# EAGLE design Controle_16_reles V5 (EAGLE 4.09)
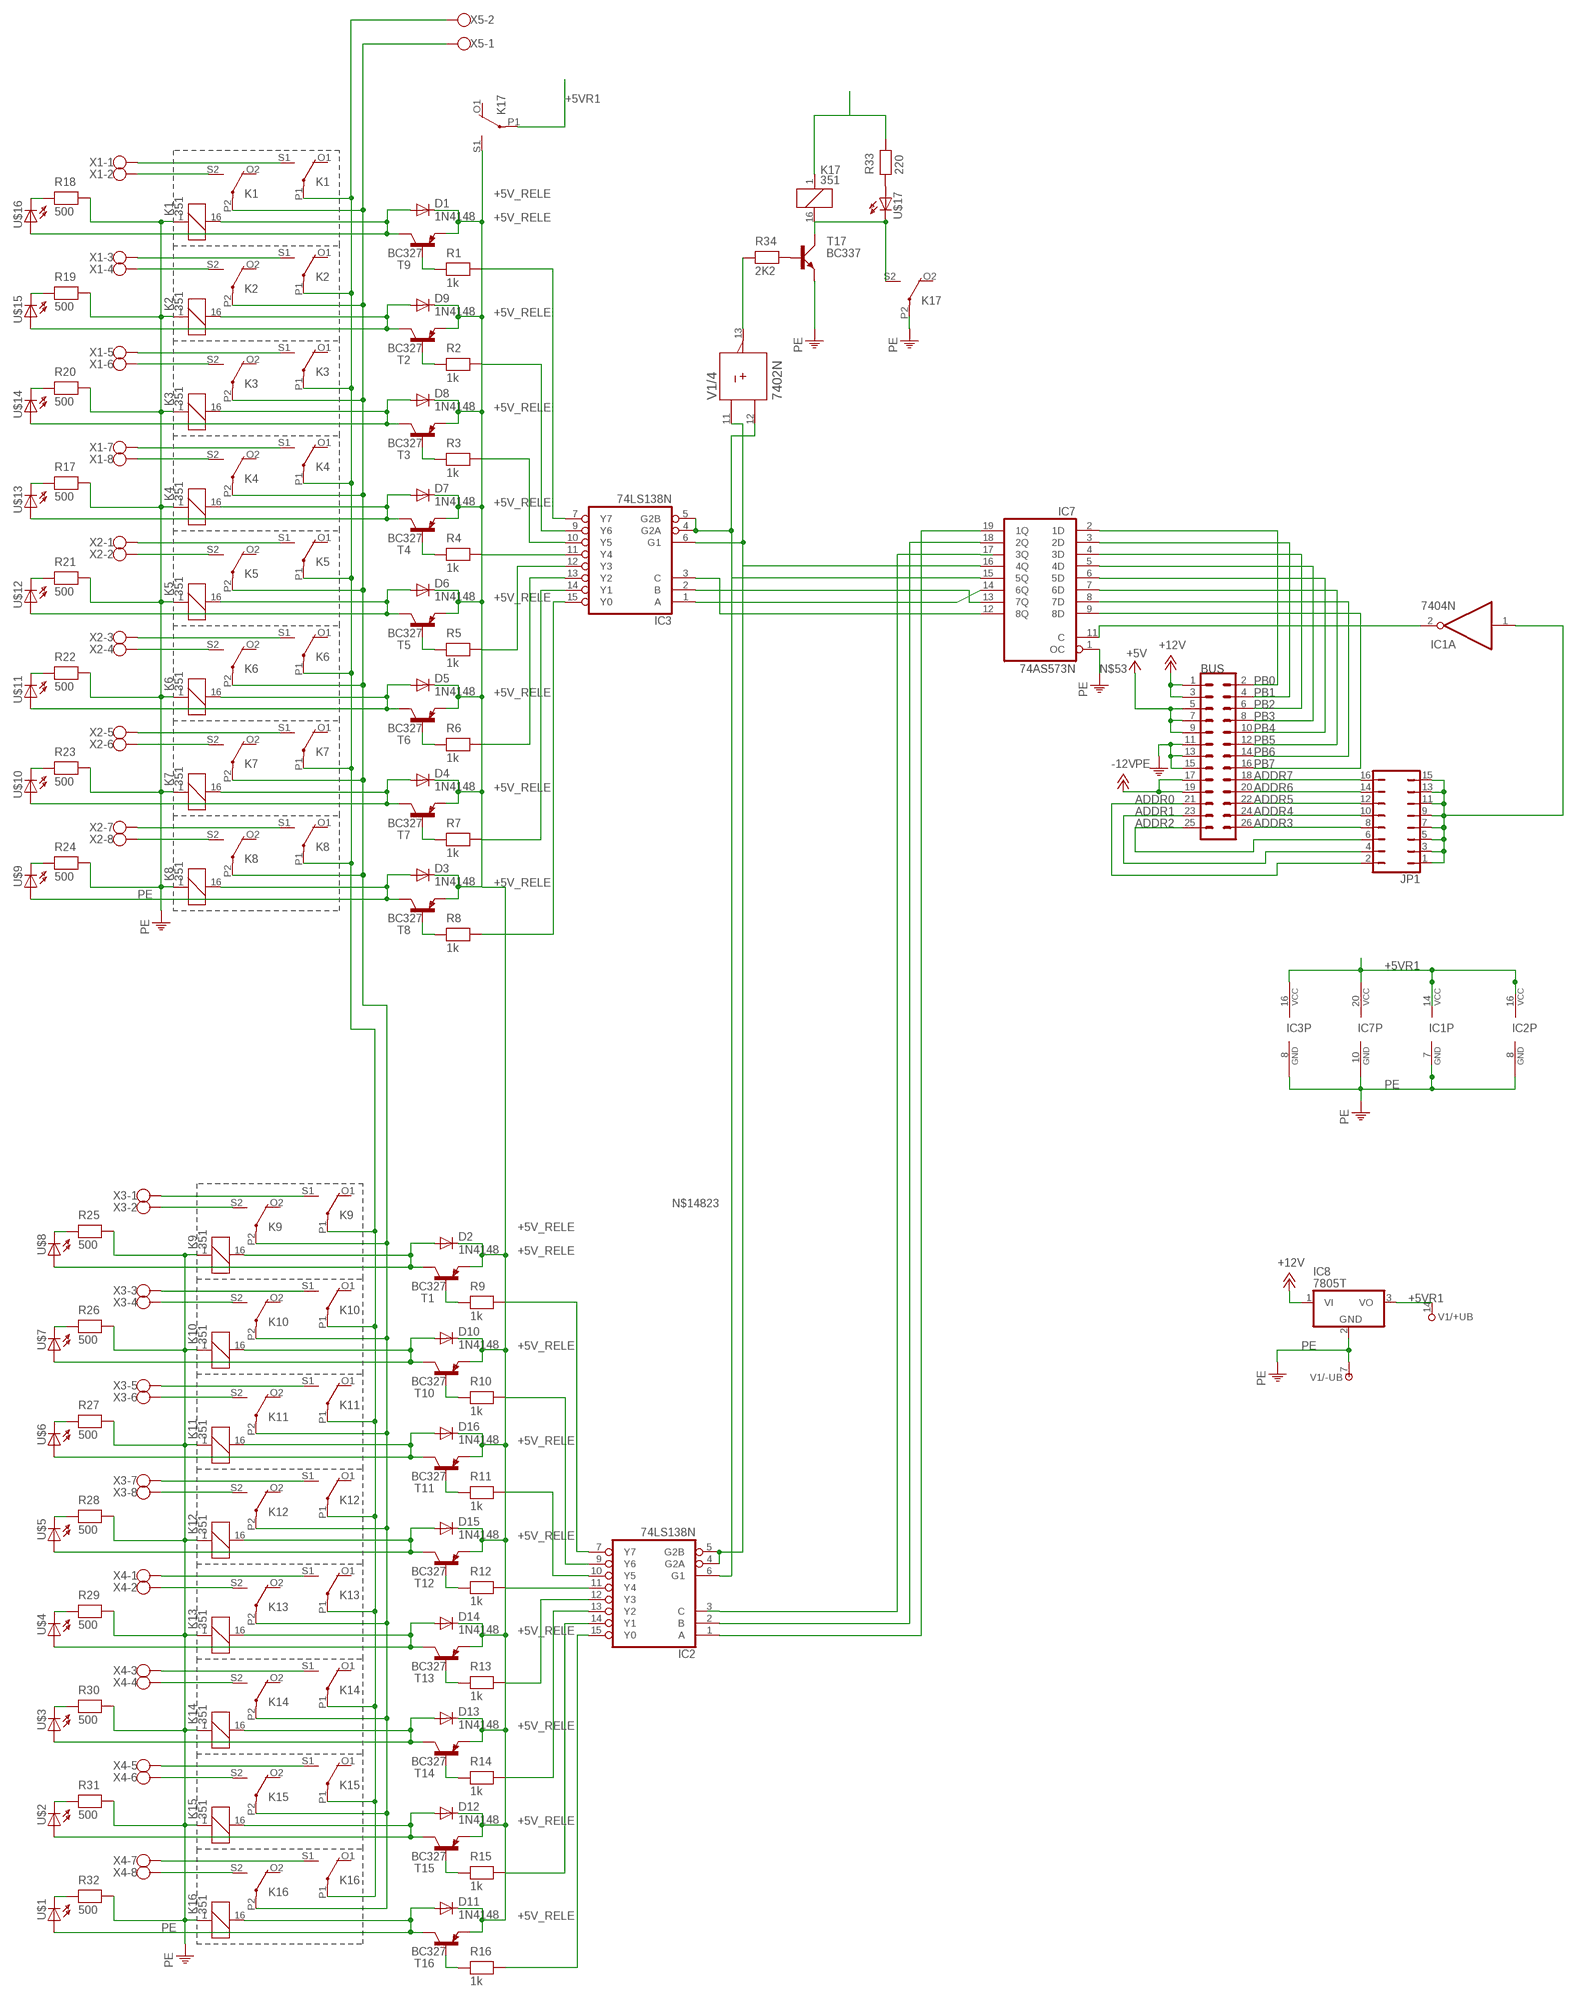
[diagram p0: schematic, sheet 1]

## Parts
BUS  ML26  [ML26]
D1  1N4148  [DO35-10]
D2  1N4148  [DO35-10]
D3  1N4148  [DO35-10]
D4  1N4148  [DO35-10]
D5  1N4148  [DO35-10]
D6  1N4148  [DO35-10]
D7  1N4148  [DO35-10]
D8  1N4148  [DO35-10]
D9  1N4148  [DO35-10]
D10  1N4148  [DO35-10]
D11  1N4148  [DO35-10]
D12  1N4148  [DO35-10]
D13  1N4148  [DO35-10]
D14  1N4148  [DO35-10]
D15  1N4148  [DO35-10]
D16  1N4148  [DO35-10]
IC1  7404N  [DIL14]
IC2  74LS138N  [DIL16]
IC3  74LS138N  [DIL16]
IC7  74AS573N  [DIL20]
IC8  7805T  [TO220H]
JP1  JP8Q  [JP8Q]
K1  351  [351]
K2  351  [351]
K3  351  [351]
K4  351  [351]
K5  351  [351]
K6  351  [351]
K7  351  [351]
K8  351  [351]
K9  351  [351]
K10  351  [351]
K11  351  [351]
K12  351  [351]
K13  351  [351]
K14  351  [351]
K15  351  [351]
K16  351  [351]
K17  351  [351]
R1  1k  RESEU-10  [R-10]
R2  1k  RESEU-10  [R-10]
R3  1k  RESEU-10  [R-10]
R4  1k  RESEU-10  [R-10]
R5  1k  RESEU-10  [R-10]
R6  1k  RESEU-10  [R-10]
R7  1k  RESEU-10  [R-10]
R8  1k  RESEU-10  [R-10]
R9  1k  RESEU-10  [R-10]
R10  1k  RESEU-10  [R-10]
R11  1k  RESEU-10  [R-10]
R12  1k  RESEU-10  [R-10]
R13  1k  RESEU-10  [R-10]
R14  1k  RESEU-10  [R-10]
R15  1k  RESEU-10  [R-10]
R16  1k  RESEU-10  [R-10]
R17  500  RESEU-10  [R-10]
R18  500  RESEU-10  [R-10]
R19  500  RESEU-10  [R-10]
R20  500  RESEU-10  [R-10]
R21  500  RESEU-10  [R-10]
R22  500  RESEU-10  [R-10]
R23  500  RESEU-10  [R-10]
R24  500  RESEU-10  [R-10]
R25  500  RESEU-10  [R-10]
R26  500  RESEU-10  [R-10]
R27  500  RESEU-10  [R-10]
R28  500  RESEU-10  [R-10]
R29  500  RESEU-10  [R-10]
R30  500  RESEU-10  [R-10]
R31  500  RESEU-10  [R-10]
R32  500  RESEU-10  [R-10]
R33  220  RESEU-10  [R-10]
R34  2K2  RESEU-10  [R-10]
T1  BC327  [TO92]
T2  BC327  [TO92]
T3  BC327  [TO92]
T4  BC327  [TO92]
T5  BC327  [TO92]
T6  BC327  [TO92]
T7  BC327  [TO92]
T8  BC327  [TO92]
T9  BC327  [TO92]
T10  BC327  [TO92]
T11  BC327  [TO92]
T12  BC327  [TO92]
T13  BC327  [TO92]
T14  BC327  [TO92]
T15  BC327  [TO92]
T16  BC327  [TO92]
T17  BC337  [SOT54A]
U$1  LED3MM  [LED3MM]
U$2  LED3MM  [LED3MM]
U$3  LED3MM  [LED3MM]
U$4  LED3MM  [LED3MM]
U$5  LED3MM  [LED3MM]
U$6  LED3MM  [LED3MM]
U$7  LED3MM  [LED3MM]
U$8  LED3MM  [LED3MM]
U$9  LED3MM  [LED3MM]
U$10  LED3MM  [LED3MM]
U$11  LED3MM  [LED3MM]
U$12  LED3MM  [LED3MM]
U$13  LED3MM  [LED3MM]
U$14  LED3MM  [LED3MM]
U$15  LED3MM  [LED3MM]
U$16  LED3MM  [LED3MM]
U$17  LED3MM  [LED3MM]
V1  7402N  [DIL14]
X1  AK500/8  [AK500/8]
X2  AK500/8  [AK500/8]
X3  AK500/8  [AK500/8]
X4  AK500/8  [AK500/8]
X5  AK300/2  [AK300/2]

## Nets
+5V: BUS.5 BUS.7 BUS.9
+5V_RELE: D1.C D2.C D3.C D4.C D5.C D6.C D7.C D8.C D9.C D10.C D11.C D12.C D13.C D14.C D15.C D16.C K17.S1(2:S) T1.1(E) T2.1(E) T3.1(E) T4.1(E) T5.1(E) T6.1(E) T7.1(E) T8.1(E) T9.1(E) T10.1(E) T11.1(E) T12.1(E) T13.1(E) T14.1(E) T15.1(E) T16.1(E)
+5VR1: IC1.14(P:VCC) IC2.16(VCC) IC3.16(VCC) IC7.20(VCC) IC8.3(VO) K17.1 K17.P1(2:P) R33.2 V1.14(/+UB:+UB)
+12V: BUS.1 BUS.3 IC8.1(VI)
-12V: BUS.17 BUS.19
ADDR0: BUS.21 JP1.2
ADDR1: BUS.23 JP1.4
ADDR2: BUS.25 JP1.6
ADDR3: BUS.26 JP1.8
ADDR4: BUS.24 JP1.10
ADDR5: BUS.22 JP1.12
ADDR6: BUS.20 JP1.14
ADDR7: BUS.18 JP1.16
GARANTIA1: IC2.6(G1) IC3.4(G2A) IC3.5(G2B) IC7.15(5Q) V1.12(/4:B)
GARANTIA2: IC2.4(G2A) IC2.5(G2B) IC3.6(G1) IC7.16(4Q) V1.11(/4:A)
N$1: R9.1 T1.2(B)
N$2: R5.1 T5.2(B)
N$3: IC3.7(Y7) R1.2
N$4: IC3.9(Y6) R2.2
N$5: IC3.10(Y5) R3.2
N$6: IC3.11(Y4) R4.2
N$7: IC3.15(Y0) R8.2
N$8: IC3.14(Y1) R7.2
N$9: IC3.13(Y2) R6.2
N$10: R1.1 T9.2(B)
N$12: IC2.2(B) IC7.18(2Q)
N$13: R34.2 T17.B
N$15: D6.A K5.16 T5.3(C) U$12.A
N$16: K17.16 K17.S2(3:S) T17.C U$17.K(C)
N$17: R2.1 T2.2(B)
N$18: D1.A K1.16 T9.3(C) U$16.A
N$19: D9.A K2.16 T2.3(C) U$15.A
N$20: R6.1 T6.2(B)
N$21: R3.1 T3.2(B)
N$22: D8.A K3.16 T3.3(C) U$14.A
N$23: D5.A K6.16 T6.3(C) U$11.A
N$24: R4.1 T4.2(B)
N$25: D7.A K4.16 T4.3(C) U$13.A
N$26: R7.1 T7.2(B)
N$27: D4.A K7.16 T7.3(C) U$10.A
N$28: R8.1 T8.2(B)
N$29: D3.A K8.16 T8.3(C) U$9.A
N$30: IC3.12(Y3) R5.2
N$32: R34.1 V1.13(/4:Y)
N$33: IC1.1(A:I) JP1.1 JP1.3 JP1.5 JP1.7 JP1.9 JP1.11 JP1.13 JP1.15
N$34: IC3.1(A) IC7.14(6Q)
N$35: K1.S1(2:S) X1.1
N$36: K1.S2(3:S) X1.2
N$37: K2.S1(2:S) X1.3
N$38: K2.S2(3:S) X1.4
N$39: K3.S1(2:S) X1.5
N$40: K3.S2(3:S) X1.6
N$41: K4.S1(2:S) X1.7
N$42: K4.S2(3:S) X1.8
N$43: K5.S1(2:S) X2.1
N$44: K5.S2(3:S) X2.2
N$45: K6.S1(2:S) X2.3
N$46: K6.S2(3:S) X2.4
N$47: K7.S1(2:S) X2.5
N$48: K7.S2(3:S) X2.6
N$49: K8.S1(2:S) X2.7
N$50: K8.S2(3:S) X2.8
N$51: R18.1 U$16.K(C)
N$52: D2.A K9.16 T1.3(C) U$8.A
N$53: IC1.2(A:O) IC7.11(C)
N$54: R10.1 T10.2(B)
N$55: D10.A K10.16 T10.3(C) U$7.A
N$56: R11.1 T11.2(B)
N$57: D16.A K11.16 T11.3(C) U$6.A
N$58: R12.1 T12.2(B)
N$60: D15.A K12.16 T12.3(C) U$5.A
N$61: R13.1 T13.2(B)
N$62: D14.A K13.16 T13.3(C) U$4.A
N$63: R14.1 T14.2(B)
N$64: D13.A K14.16 T14.3(C) U$3.A
N$65: R15.1 T15.2(B)
N$66: D12.A K15.16 T15.3(C) U$2.A
N$67: R16.1 T16.2(B)
N$68: D11.A K16.16 T16.3(C) U$1.A
N$69: IC2.7(Y7) R9.2
N$70: IC2.9(Y6) R10.2
N$71: IC2.10(Y5) R11.2
N$72: IC2.11(Y4) R12.2
N$73: IC2.15(Y0) R16.2
N$74: IC2.14(Y1) R15.2
N$75: IC2.13(Y2) R14.2
N$76: IC2.12(Y3) R13.2
N$77: IC3.2(B) IC7.13(7Q)
N$78: K9.S1(2:S) X3.1
N$79: K9.S2(3:S) X3.2
N$80: K10.S1(2:S) X3.3
N$81: K10.S2(3:S) X3.4
N$82: K11.S1(2:S) X3.5
N$83: K11.S2(3:S) X3.6
N$84: K12.S1(2:S) X3.7
N$85: K12.S2(3:S) X3.8
N$86: K13.S1(2:S) X4.1
N$87: K13.S2(3:S) X4.2
N$88: K14.S1(2:S) X4.3
N$89: K14.S2(3:S) X4.4
N$90: K15.S1(2:S) X4.5
N$91: K15.S2(3:S) X4.6
N$92: K16.S1(2:S) X4.7
N$93: K16.S2(3:S) X4.8
N$94: R20.1 U$14.K(C)
N$95: R19.1 U$15.K(C)
N$96: R32.1 U$1.K(C)
N$97: IC3.3(C) IC7.12(8Q)
N$98: R17.1 U$13.K(C)
N$112: R33.1 U$17.A
N$114: IC2.3(C) IC7.17(3Q)
N$118: IC2.1(A) IC7.19(1Q)
N$148: K1.P1(2:P) K2.P1(2:P) K3.P1(2:P) K4.P1(2:P) K5.P1(2:P) K6.P1(2:P) K7.P1(2:P) K8.P1(2:P) K9.P1(2:P) K10.P1(2:P) K11.P1(2:P) K12.P1(2:P) K13.P1(2:P) K14.P1(2:P) K15.P1(2:P) K16.P1(2:P) X5.2
N$150: R21.1 U$12.K(C)
N$153: R22.1 U$11.K(C)
N$156: R23.1 U$10.K(C)
N$160: R24.1 U$9.K(C)
N$163: R25.1 U$8.K(C)
N$165: R26.1 U$7.K(C)
N$169: R27.1 U$6.K(C)
N$171: R28.1 U$5.K(C)
N$174: R29.1 U$4.K(C)
N$177: R30.1 U$3.K(C)
N$180: R31.1 U$2.K(C)
N$14823: K1.P2(3:P) K2.P2(3:P) K3.P2(3:P) K4.P2(3:P) K5.P2(3:P) K6.P2(3:P) K7.P2(3:P) K8.P2(3:P) K9.P2(3:P) K10.P2(3:P) K11.P2(3:P) K12.P2(3:P) K13.P2(3:P) K14.P2(3:P) K15.P2(3:P) K16.P2(3:P) X5.1
PB0: BUS.2 IC7.2(1D)
PB1: BUS.4 IC7.3(2D)
PB2: BUS.6 IC7.4(3D)
PB3: BUS.8 IC7.5(4D)
PB4: BUS.10 IC7.6(5D)
PB5: BUS.12 IC7.7(6D)
PB6: BUS.14 IC7.8(7D)
PB7: BUS.16 IC7.9(8D)
PE: BUS.11 BUS.13 BUS.15 IC1.7(P:GND) IC2.8(GND) IC3.8(GND) IC7.1(OC) IC7.10(GND) IC8.2(GND) K1.1 K2.1 K3.1 K4.1 K5.1 K6.1 K7.1 K8.1 K9.1 K10.1 K11.1 K12.1 K13.1 K14.1 K15.1 K16.1 K17.P2(3:P) R17.2 R18.2 R19.2 R20.2 R21.2 R22.2 R23.2 R24.2 R25.2 R26.2 R27.2 R28.2 R29.2 R30.2 R31.2 R32.2 T17.E V1.7(/-UB:-UB)
Unconnected: IC1.3(B:I) IC1.4(B:O) IC1.5(C:I) IC1.6(C:O) IC1.8(D:O) IC1.9(D:I) IC1.10(E:O) IC1.11(E:I) IC1.12(F:O) IC1.13(F:I) K1.O1(2:O) K1.O2(3:O) K2.O1(2:O) K2.O2(3:O) K3.O1(2:O) K3.O2(3:O) K4.O1(2:O) K4.O2(3:O) K5.O1(2:O) K5.O2(3:O) K6.O1(2:O) K6.O2(3:O) K7.O1(2:O) K7.O2(3:O) K8.O1(2:O) K8.O2(3:O) K9.O1(2:O) K9.O2(3:O) K10.O1(2:O) K10.O2(3:O) K11.O1(2:O) K11.O2(3:O) K12.O1(2:O) K12.O2(3:O) K13.O1(2:O) K13.O2(3:O) K14.O1(2:O) K14.O2(3:O) K15.O1(2:O) K15.O2(3:O) K16.O1(2:O) K16.O2(3:O) K17.O1(2:O) K17.O2(3:O) V1.1(/1:Y) V1.2(/1:A) V1.3(/1:B) V1.4(/2:Y) V1.5(/2:A) V1.6(/2:B) V1.8(/3:A) V1.9(/3:B) V1.10(/3:Y)

## Library data of the parts
BUS = con-harting-ml:ML26: HARTING
D1-D16 = diode:1N4148: DIODE high speed (Philips)
IC1 = 74xx-us:74*04: Hex INVERTER
IC2 IC3 = 74xx-us:74*138: 3-line to 8-line DECODER/DEMULTIPLEXER
IC7 = 74xx-us:74*573: 8-bit D latch BUS DRIVER
IC8 = linear:78*: Positive VOLTAGE REGULATOR
JP1 = jumper:JP8Q: JUMPER
K1-K17 = relay:351: RELAY 2 x switch, Omron
R1-R34 = discrete:RESEU-10
T1-T16 = transistor-pnp:BC327: PNP Transistor
T17 = transistor-small-signal:BC337: NPN TRANSISTOR
U$1-U$17 = led:LED: LED
V1 = 74ttl-din:74*02: Quad 2-input NOR gate
X1-X4 = con-ptr500:AK500/8: CONNECTOR
X5 = con-ptr500:AK300/2: CONNECTOR

## Board
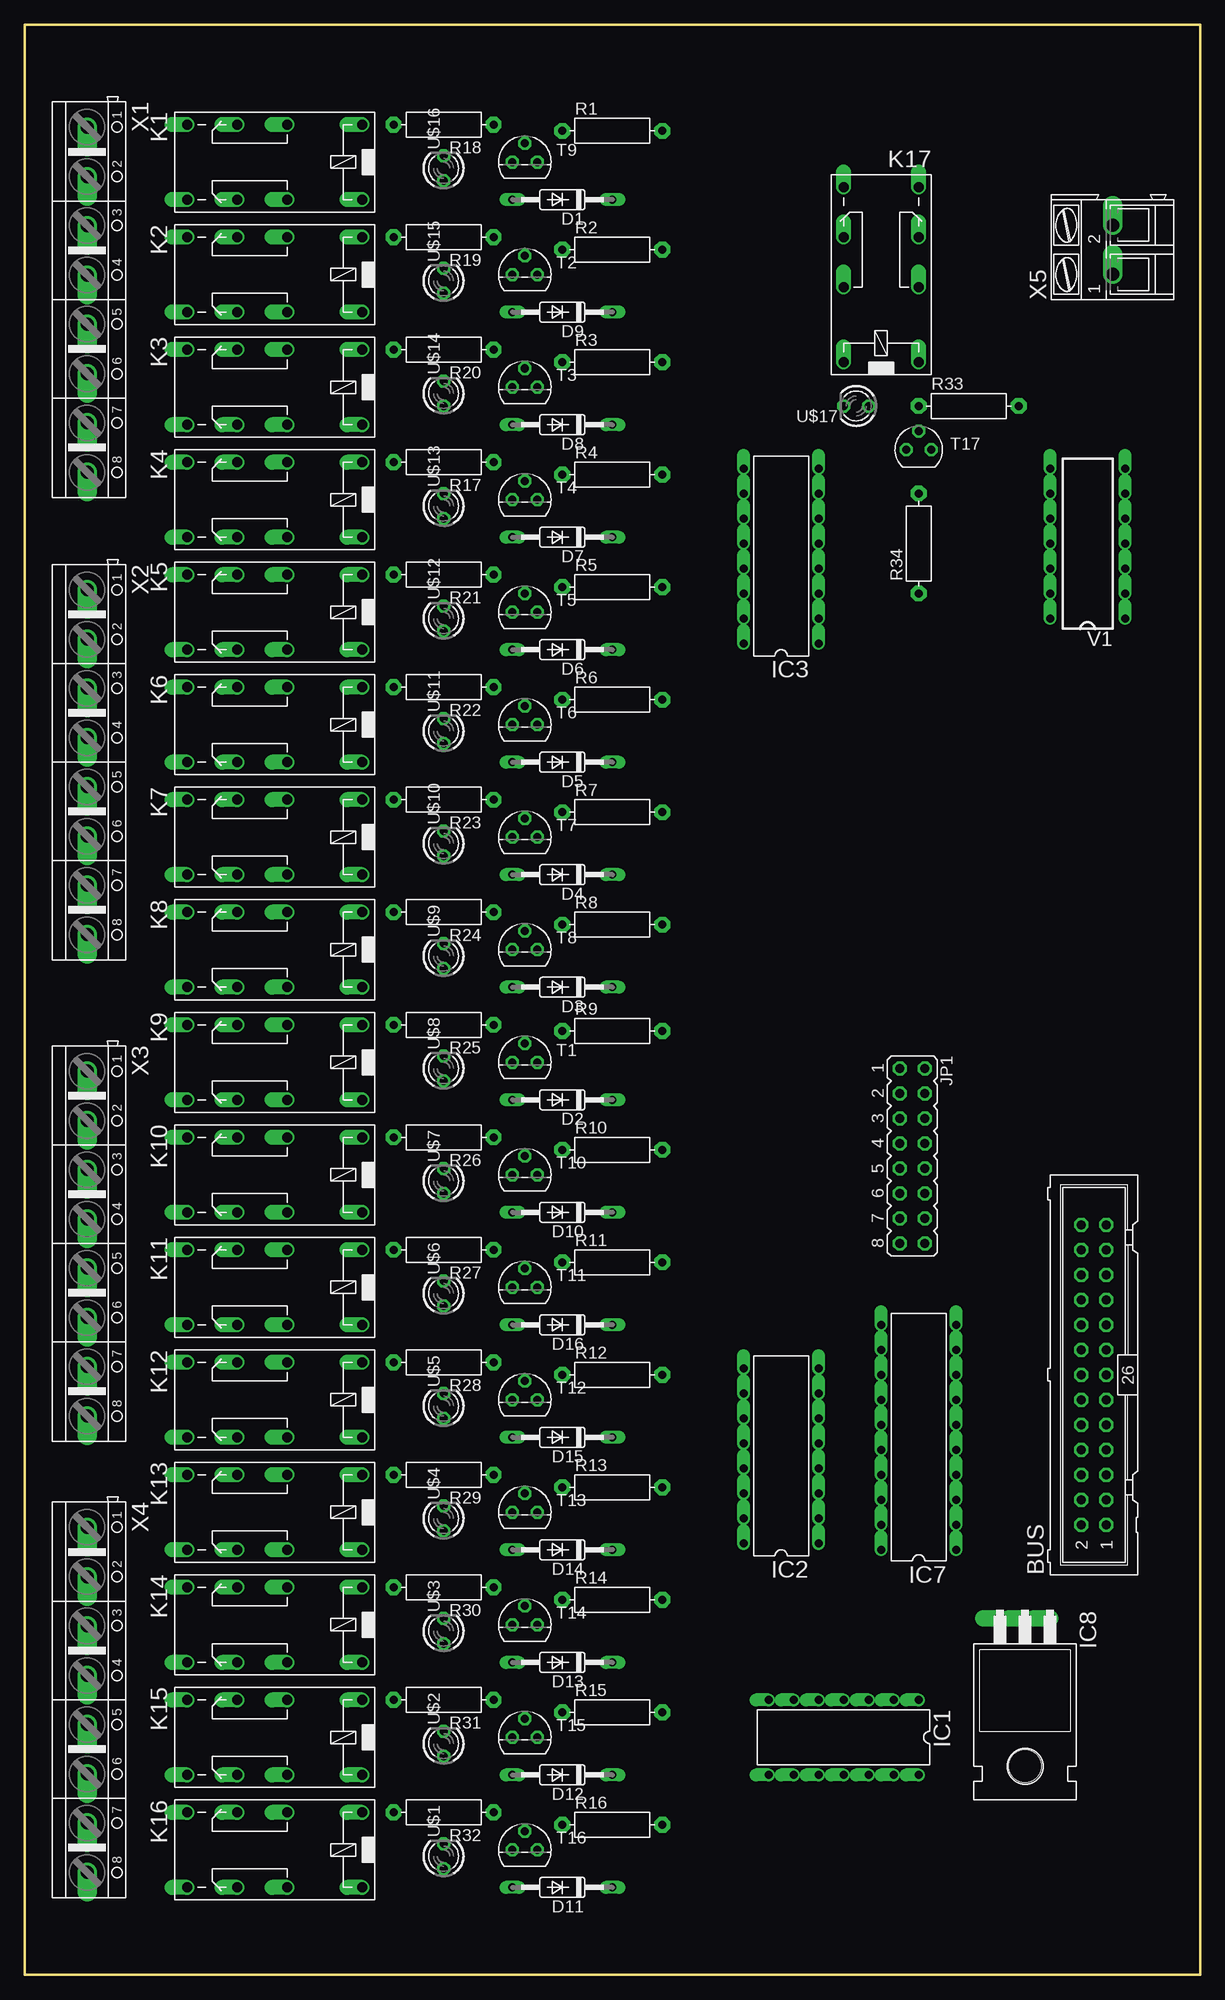
[diagram p1: board, top side]
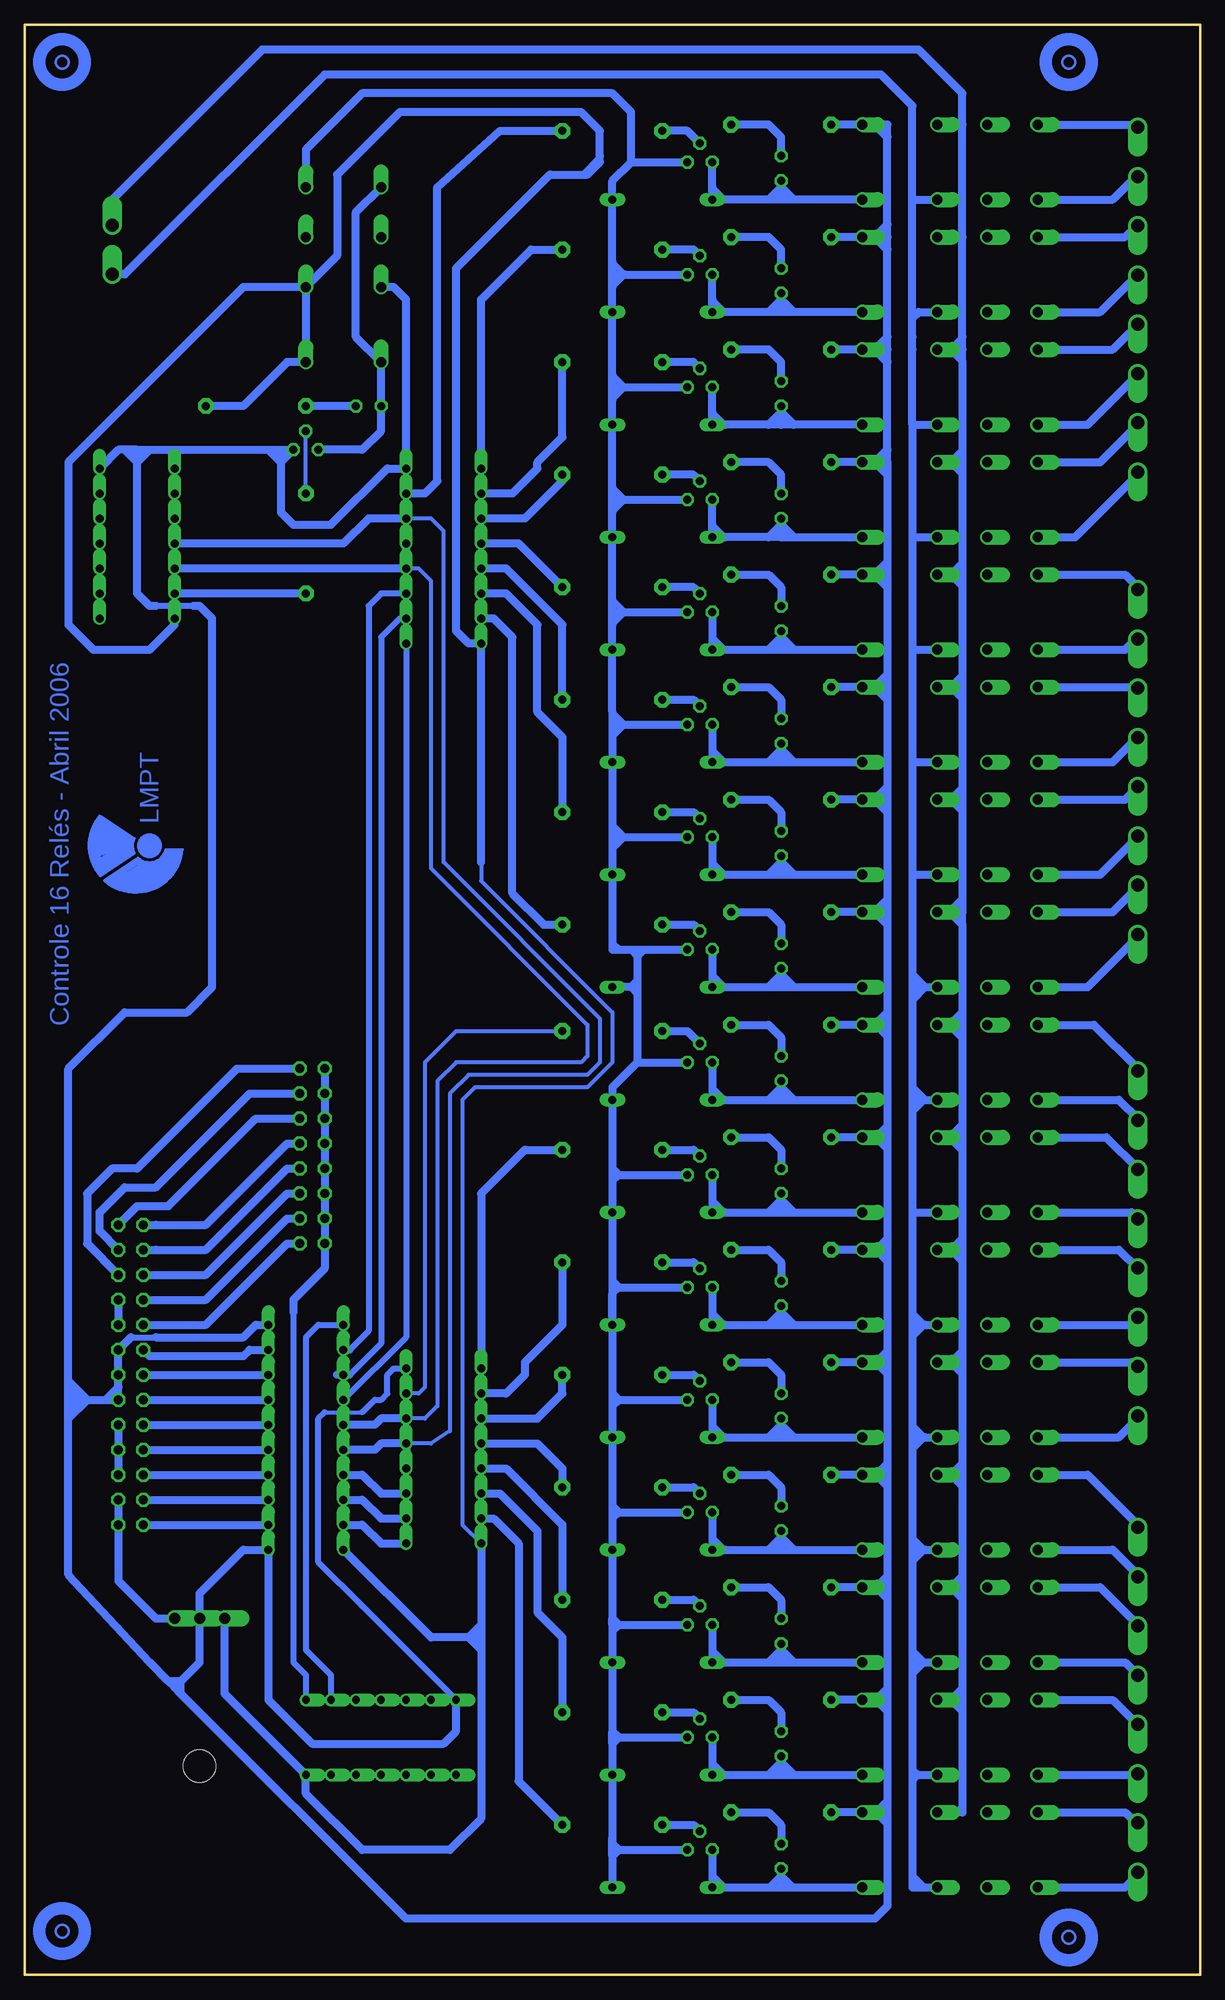
[diagram p2: board, bottom side, seen from below]

Size 119.38 x 198.12 mm. Coordinates in mm from the lower left corner, seen from the top.
Outline: 119.38,198.12 119.38,0 0,0 0,198.12 119.38,198.12
Copper layers used: Bottom

### Footprints (pad centres in the part's own frame; a part is rotated, then mirrored left to right if it is on the bottom)
ML26 = drill 0.914 octagon: 1 -15.24,-1.27; 2 -15.24,1.27; 3 -12.7,-1.27; 4 -12.7,1.27; 5 -10.16,-1.27; 6 -10.16,1.27; 7 -7.62,-1.27; 8 -7.62,1.27; 9 -5.08,-1.27; 10 -5.08,1.27; 11 -2.54,-1.27; 12 -2.54,1.27; 13 0,-1.27; 14 0,1.27; 15 2.54,-1.27; 16 2.54,1.27; 17 5.08,-1.27; 18 5.08,1.27; 19 7.62,-1.27; 20 7.62,1.27; 21 10.16,-1.27; 22 10.16,1.27; 23 12.7,-1.27; 24 12.7,1.27; 25 15.24,-1.27; 26 15.24,1.27
DO35-10 = drill 0.813 long: A 5.08,0; C -5.08,0
DIL14 = drill 0.8 offset: 1 -7.62,-3.81; 2 -5.08,-3.81; 3 -2.54,-3.81; 4 0,-3.81; 5 2.54,-3.81; 6 5.08,-3.81; 7 7.62,-3.81; 8 7.62,3.81; 9 5.08,3.81; 10 2.54,3.81; 11 0,3.81; 12 -2.54,3.81; 13 -5.08,3.81; 14 -7.62,3.81
DIL16 = drill 0.813 offset: 1 -8.89,-3.81; 2 -6.35,-3.81; 3 -3.81,-3.81; 4 -1.27,-3.81; 5 1.27,-3.81; 6 3.81,-3.81; 7 6.35,-3.81; 8 8.89,-3.81; 9 8.89,3.81; 10 6.35,3.81; 11 3.81,3.81; 12 1.27,3.81; 13 -1.27,3.81; 14 -3.81,3.81; 15 -6.35,3.81; 16 -8.89,3.81
DIL20 = drill 0.813 offset: 1 -11.43,-3.81; 2 -8.89,-3.81; 3 -6.35,-3.81; 4 -3.81,-3.81; 5 -1.27,-3.81; 6 1.27,-3.81; 7 3.81,-3.81; 8 6.35,-3.81; 9 8.89,-3.81; 10 11.43,-3.81; 11 11.43,3.81; 12 8.89,3.81; 13 6.35,3.81; 14 3.81,3.81; 15 1.27,3.81; 16 -1.27,3.81; 17 -3.81,3.81; 18 -6.35,3.81; 19 -8.89,3.81; 20 -11.43,3.81
TO220H = drill 1.118 offset: 1 -2.54,-10.16; 2 0,-10.16; 3 2.54,-10.16 | hole 3.302: 0,4.826
JP8Q = drill 0.914 octagon: 1 -8.89,-1.27; 2 -8.89,1.27; 3 -6.35,-1.27; 4 -6.35,1.27; 5 -3.81,-1.27; 6 -3.81,1.27; 7 -1.27,-1.27; 8 -1.27,1.27; 9 1.27,-1.27; 10 1.27,1.27; 11 3.81,-1.27; 12 3.81,1.27; 13 6.35,-1.27; 14 6.35,1.27; 15 8.89,-1.27; 16 8.89,1.27
351 = drill 1.016 offset: 1 -3.81,-3.81; 16 -3.81,3.81; O1 8.89,-3.81; O2 8.89,3.81; P1 3.81,-3.81; P2 3.81,3.81; S1 13.97,-3.81; S2 13.97,3.81
R-10 = drill 0.813 pad 1.6 octagon: 1 -5.08,0; 2 5.08,0
TO92 = drill 0.813 octagon: 1 1.27,0; 2 0,1.905; 3 -1.27,0
SOT54A = drill 0.813 octagon: B 0,1.905; C -1.27,0; E 1.27,0
LED3MM = drill 0.813 octagon: A -1.27,0; K 1.27,0
DIL14' = drill 0.813 offset: 1 -7.62,-3.81; 2 -5.08,-3.81; 3 -2.54,-3.81; 4 0,-3.81; 5 2.54,-3.81; 6 5.08,-3.81; 7 7.62,-3.81; 8 7.62,3.81; 9 5.08,3.81; 10 2.54,3.81; 11 0,3.81; 12 -2.54,3.81; 13 -5.08,3.81; 14 -7.62,3.81
AK500/8 = drill 1.321 offset: 1 -17.526,0; 2 -12.497,0; 3 -7.518,0; 4 -2.489,0; 5 2.489,0; 6 7.518,0; 7 12.497,0; 8 17.526,0
AK300/2 = drill 1.321 offset: 1 -2.515,0; 2 2.489,0

### Placement (x,y rotation side)
BUS  108.59,60.96 90 top
D1  54.61,180.34 180 top
D2  54.61,88.9 180 top
D3  54.61,100.33 180 top
D4  54.61,111.76 180 top
D5  54.61,123.19 180 top
D6  54.61,134.62 180 top
D7  54.61,146.05 180 top
D8  54.61,157.48 180 top
D9  54.61,168.91 180 top
D10  54.61,77.47 180 top
D11  54.61,8.89 180 top
D12  54.61,20.32 180 top
D13  54.61,31.75 180 top
D14  54.61,43.18 180 top
D15  54.61,54.61 180 top
D16  54.61,66.04 180 top
IC1  83.19,24.13 180 top
IC2  76.83,52.7 90 top
IC3  76.83,144.14 90 top
IC7  90.8,54.61 90 top
IC8  101.6,26.03 180 top
JP1  90.17,83.19 270 top
K1  30.48,184.15 180 top
K2  30.48,172.72 180 top
K3  30.48,161.29 180 top
K4  30.48,149.86 180 top
K5  30.48,138.43 180 top
K6  30.48,127 180 top
K7  30.48,115.57 180 top
K8  30.48,104.14 180 top
K9  30.48,92.71 180 top
K10  30.48,81.28 180 top
K11  30.48,69.85 180 top
K12  30.48,58.42 180 top
K13  30.48,46.99 180 top
K14  30.48,35.56 180 top
K15  30.48,24.13 180 top
K16  30.48,12.7 180 top
K17  87,167.64 90 top
R1  59.69,187.32 0 top
R2  59.69,175.26 0 top
R3  59.69,163.83 0 top
R4  59.69,152.4 0 top
R5  59.69,140.97 0 top
R6  59.69,129.54 0 top
R7  59.69,118.11 0 top
R8  59.69,106.68 0 top
R9  59.69,95.88 0 top
R10  59.69,83.82 0 top
R11  59.69,72.39 0 top
R12  59.69,60.96 0 top
R13  59.69,49.53 0 top
R14  59.69,38.1 0 top
R15  59.69,26.67 0 top
R16  59.69,15.24 0 top
R17  42.54,153.67 180 top
R18  42.54,187.96 180 top
R19  42.54,176.53 180 top
R20  42.54,165.1 180 top
R21  42.54,142.24 180 top
R22  42.54,130.81 180 top
R23  42.54,119.38 180 top
R24  42.54,107.95 180 top
R25  42.54,96.52 180 top
R26  42.54,85.09 180 top
R27  42.54,73.66 180 top
R28  42.54,62.23 180 top
R29  42.54,50.8 180 top
R30  42.54,39.37 180 top
R31  42.54,27.94 180 top
R32  42.54,16.51 180 top
R33  95.88,159.38 0 top
R34  90.8,145.41 90 top
T1  50.8,92.71 0 top
T2  50.8,172.72 0 top
T3  50.8,161.29 0 top
T4  50.8,149.86 0 top
T5  50.8,138.43 0 top
T6  50.8,127 0 top
T7  50.8,115.57 0 top
T8  50.8,104.14 0 top
T9  50.8,184.15 0 top
T10  50.8,81.28 0 top
T11  50.8,69.85 0 top
T12  50.8,58.42 0 top
T13  50.8,46.99 0 top
T14  50.8,35.56 0 top
T15  50.8,24.13 0 top
T16  50.8,12.7 0 top
T17  90.8,154.94 0 top
U$1  42.54,12.06 90 top
U$2  42.54,23.49 90 top
U$3  42.54,34.92 90 top
U$4  42.54,46.35 90 top
U$5  42.54,57.78 90 top
U$6  42.54,69.22 90 top
U$7  42.54,80.64 90 top
U$8  42.54,92.07 90 top
U$9  42.54,103.5 90 top
U$10  42.54,114.94 90 top
U$11  42.54,126.36 90 top
U$12  42.54,137.79 90 top
U$13  42.54,149.22 90 top
U$14  42.54,160.66 90 top
U$15  42.54,172.08 90 top
U$16  42.54,183.51 90 top
U$17  84.45,159.38 180 top
V1  7402N  [DIL14']  107.95,145.41 90 top
X1  6.35,170.18 270 top
X2  6.35,123.19 270 top
X3  6.35,74.29 270 top
X4  6.35,27.94 270 top
X5  110.49,175.26 90 top

### Tracks (layer width: path | path; a pad name or v marks a point on that pad's centre or on a via)
+5V
  Bottom 0.813: BUS.5 BUS.7 BUS.9
+5V_RELE
  Bottom 0.61: 59.69,125.73 58.42,127 59.69,128.27 | 59.69,139.7 58.42,138.43 59.69,137.16 | 59.69,151.13 58.42,149.86 59.69,148.59 | 59.69,162.56 58.42,161.29 59.69,160.02 | 59.69,173.99 58.42,172.72 59.69,171.45 | 59.69,116.84 58.42,115.57 59.69,114.3
  Bottom 0.813: D4.C 59.69,114.3 59.69,115.57 | 59.69,115.57 58.42,115.57 T7.1 59.69,115.57 | 59.69,127 59.69,125.73 D5.C 59.69,116.84 59.69,115.57 | 59.69,127 58.42,127 T6.1 | 59.69,138.43 59.69,137.16 D6.C 59.69,128.27 59.69,127 | 59.69,138.43 58.42,138.43 T5.1 | 59.69,149.86 59.69,148.59 D7.C 59.69,139.7 59.69,138.43 | 59.69,149.86 58.42,149.86 T4.1 | 59.69,161.29 59.69,160.02 D8.C 59.69,151.13 59.69,149.86 | 59.69,161.29 58.42,161.29 T3.1 | 59.69,172.72 59.69,171.45 D9.C 59.69,162.56 59.69,161.29 | 59.69,172.72 58.42,172.72 T2.1 | 59.69,172.72 59.69,173.99 D1.C 59.69,182.25 57.78,184.15 | 59.69,115.57 D4.C | D4.C 59.69,105.41 | 59.69,104.14 57.78,104.14 | 59.69,81.91 D2.C 59.69,90.17 57.15,92.71 | 59.69,81.28 59.69,80.64 | 57.15,104.14 56.52,104.14 | 56.52,104.14 T8.1 | 59.69,104.14 59.05,104.14 | 59.69,105.41 59.69,104.14 | 59.69,105.41 59.69,104.77 59.05,104.14 | 59.05,104.14 57.78,104.14 | 57.78,104.14 57.15,104.14 | 57.15,104.14 57.15,103.5 | 57.15,103.5 57.15,100.97 | 57.15,100.97 57.15,100.33 | 57.15,100.33 57.15,99.69 | 57.15,99.69 57.15,92.71 | 57.15,92.71 T1.1 | 59.05,81.28 T10.1 | 59.69,81.28 59.05,81.28 | 59.69,81.91 59.69,81.28 | 59.69,81.91 59.05,81.28 | 59.05,81.28 59.69,80.64 | 59.69,80.64 D10.C 59.69,70.48 | 59.69,70.48 59.69,69.85 | 59.69,69.85 59.05,69.85 | 59.05,69.85 T11.1 | D16.C 59.69,68.58 | 59.69,69.85 59.69,68.58 | 59.69,68.58 59.69,69.22 59.05,69.85 | 59.69,70.48 59.05,69.85 | 59.69,70.48 D16.C | D16.C 59.69,59.69 | 59.69,59.69 59.69,58.42 | 59.69,57.78 D15.C 59.69,47.62 | 59.69,47.62 59.69,46.99 | 59.69,45.72 D14.C 59.69,36.19 | 59.69,34.92 D13.C 59.69,24.77 | 59.69,23.49 D12.C 59.69,13.97 | 59.69,12.06 D11.C | 59.69,12.06 59.69,12.7
  Bottom 0.813: 59.05,12.7 T16.1 | 59.69,12.7 59.05,12.7 | 59.69,12.7 59.69,13.97 | 59.69,13.97 59.69,13.33 59.05,12.7 | 59.69,12.06 59.05,12.7 | 59.69,23.49 59.69,12.06 | 59.69,23.49 59.69,24.13 | 59.05,24.13 T15.1 | 59.69,24.13 59.05,24.13 | 59.69,24.13 59.69,24.77 | 59.05,24.13 59.69,24.77 | 59.69,23.49 59.05,24.13 | 59.69,34.92 59.69,23.49 | 59.05,35.56 T14.1 | 59.69,36.19 59.05,35.56 | 59.69,35.56 59.69,36.19 | 59.69,35.56 59.69,34.92 | 59.69,34.92 59.05,35.56 | 59.69,35.56 59.05,35.56 | 59.69,45.72 59.69,35.56 | 59.05,46.99 T13.1 | 59.69,46.99 59.05,46.99 | 59.69,46.99 59.69,45.72 | 59.69,45.72 59.69,46.35 59.05,46.99 | 59.69,47.62 59.05,46.99 | 59.69,57.78 59.69,47.62 | 59.69,58.42 59.69,57.78 | 59.69,58.42 59.05,58.42 | 59.05,58.42 T12.1 | 59.69,57.78 59.05,58.42 | 59.69,59.69 59.69,57.78 | 59.69,59.69 59.69,59.05 59.05,58.42 | 57.78,184.15 T9.1 | 57.78,184.15 57.78,189.23 59.69,191.13 85.09,191.13 90.8,185.42 90.8,182.25 K17.S1 | 57.78,100.33 D3.C | 57.15,100.33 57.78,100.33 | 57.15,100.97 57.78,100.33 | 57.15,100.97 57.15,99.69 | 57.78,100.33 57.15,99.69 | 57.15,103.5 56.52,104.14 | 57.78,104.14 57.15,103.5
+5VR1
  Bottom 0.406: IC2.16 74.93,45.72 74.93,88.9 73.66,90.17 62.23,90.17 | 62.23,90.17 60.96,91.44 | 62.23,90.17 59.69,92.71 59.69,97.79 73.02,111.12 73.02,113.03 | 66.04,182.88 62.86,182.88 60.96,184.78
  Bottom 0.813: IC7.20 78.11,34.29 74.3,34.29 | 73.02,34.29 74.3,34.29 | 73.02,35.56 73.02,34.29 | IC2.16 73.02,35.56 | 73.02,34.29 73.02,33.02 | IC8.3 99.06,28.58 IC1.14 90.8,18.41 85.09,12.7 76.2,12.7 73.02,15.88 73.02,33.02 | 73.02,35.56 74.3,34.29 | 74.3,34.29 73.02,33.02 | V1.14 104.14,137.16 106.68,134.62 112.39,134.62 114.94,137.16 114.94,153.67 97.16,171.45 K17.P1 | K17.P1 87.63,174.62 87.63,182.88 81.28,189.23 62.86,189.23 60.96,187.32 60.96,184.78 60.96,184.15 62.23,182.88 66.04,182.88 75.56,173.35 75.56,136.53 74.3,135.25 IC3.16 73.02,113.03 | R33.2 97.16,159.38 92.71,163.83 K17.1 K17.P1
+12V
  Bottom 0.813: BUS.3 BUS.1 109.85,40 106.05,36.19 IC8.1
-12V
  Bottom 0.813: BUS.19 BUS.17
ADDR0
  Bottom 0.813: BUS.21 113.03,74.29 113.03,79.38 110.49,81.91 107.95,81.91 97.79,92.07 JP1.2
ADDR1
  Bottom 0.813: JP1.4 96.52,89.53 106.05,80.01 109.22,80.01 111.76,77.47 111.76,75.56 BUS.23
ADDR2
  Bottom 0.813: JP1.6 95.88,87 104.78,78.1 107.95,78.1 BUS.25
ADDR3
  Bottom 0.813: 106.05,76.2 BUS.26 100.97,76.2 92.71,84.45 JP1.8
ADDR4
  Bottom 0.813: 106.05,73.66 BUS.24 100.97,73.66 92.71,81.91 JP1.10
ADDR5
  Bottom 0.813: JP1.12 92.71,79.38 100.97,71.12 BUS.22
ADDR6
  Bottom 0.813: JP1.14 92.71,76.83 100.97,68.58 BUS.20
ADDR7
  Bottom 0.813: JP1.16 92.71,74.29 100.97,66.04 BUS.18
GARANTIA1
  Bottom 0.406: IC3.4 79.38,142.88 78.11,141.6 78.11,112.39 62.23,96.52 62.23,93.34 62.86,92.71 75.56,92.71 77.47,90.8 77.47,57.78 78.74,56.51 IC2.6
  Bottom 0.813: V1.12 IC3.4 IC3.5 | IC2.6 83.19,56.51 83.82,55.88 IC7.15
GARANTIA2
  Bottom 0.406: IC3.6 78.11,147.95 76.83,146.69 76.83,113.03 60.96,97.16 60.96,92.71 62.23,91.44 74.3,91.44 76.2,89.53 76.2,55.24 78.11,53.97 IC2.5
  Bottom 0.813: IC3.6 84.45,147.95 87,145.41 V1.11 | IC2.4 IC2.5 83.19,53.97 83.82,53.34 IC7.16
N$1
  Bottom 0.813: T1.2 52.07,95.88 R9.1
N$2
  Bottom 0.813: R5.1 51.44,140.97 T5.2
N$3
  Bottom 0.813: R1.2 71.12,187.32 77.47,181.61 77.47,151.76 78.74,150.5 IC3.7
N$4
  Bottom 0.813: R2.2 67.94,175.26 73.02,170.18 IC3.9
N$5
  Bottom 0.813: IC3.10 69.85,150.5 67.31,153.03 67.31,153.67 64.77,156.21 R3.2
N$6
  Bottom 0.813: R4.2 64.77,151.76 68.58,147.95 IC3.11
N$7
  Bottom 0.813: IC3.15 71.75,137.79 69.85,135.89 69.85,109.85 66.67,106.68 R8.2
N$8
  Bottom 0.813: R7.2 64.77,125.73 67.31,128.27 67.31,137.16 70.48,140.34 IC3.14
N$9
  Bottom 0.813: R6.2 64.77,137.16 70.48,142.88 IC3.13
N$10
  Bottom 0.813: R1.1 52.07,187.32 T9.2
N$11
  Bottom 0.254: 103.33,114.33 105.06,114.33
N$12
  Bottom 0.813: IC7.18 85.09,48.26 83.19,46.35 IC2.2
N$13
  Bottom 0.406: R34.2 T17.B
N$15
  Bottom 0.61: 49.53,135.89 48.26,134.62
  Bottom 0.813: T5.3 49.53,135.89 D6.A 48.26,134.62 43.81,134.62 | 43.81,134.62 42.54,134.62 | 42.54,134.62 41.27,134.62 | 41.27,134.62 K5.16 | 42.54,135.89 U$12.A | 42.54,134.62 42.54,135.89 | 43.81,134.62 42.54,135.89 | 42.54,135.89 41.27,134.62
N$16
  Bottom 0.813: T17.C 85.09,154.94 83.19,156.84 U$17.K K17.16 85.72,166.37 85.72,179.07 K17.S2
N$17
  Bottom 0.813: R2.1 51.44,175.26 T2.2
N$18
  Bottom 0.61: 48.26,180.34 49.53,181.61
  Bottom 0.813: T9.3 49.53,181.61 D1.A 48.26,180.34 43.81,180.34 | K1.16 41.27,180.34 | 41.27,180.34 42.54,180.34 | 42.54,180.34 43.81,180.34 | 42.54,181.61 U$16.A | 42.54,180.34 42.54,181.61 | 42.54,181.61 43.81,180.34 | 41.27,180.34 42.54,181.61
N$19
  Bottom 0.61: 48.26,168.91 49.53,170.18
  Bottom 0.813: T2.3 49.53,170.18 D9.A 48.26,168.91 43.81,168.91 | K2.16 41.27,168.91 | 41.27,168.91 42.54,168.91 | 42.54,168.91 43.81,168.91 | 42.54,170.18 U$15.A | 42.54,168.91 42.54,170.18 | 42.54,170.18 43.81,168.91 | 41.27,168.91 42.54,170.18
N$20
  Bottom 0.813: R6.1 51.44,129.54 T6.2
N$21
  Bottom 0.813: R3.1 51.44,163.83 T3.2
N$22
  Bottom 0.61: 48.26,157.48 49.53,158.75
  Bottom 0.813: T3.3 49.53,158.75 D8.A 48.26,157.48 43.81,157.48 | K3.16 41.27,157.48 | 41.27,157.48 42.54,157.48 | 42.54,157.48 43.81,157.48 | 42.54,158.75 U$14.A | 42.54,157.48 42.54,158.75 | 42.54,158.75 43.81,157.48 | 41.27,157.48 42.54,158.75
N$23
  Bottom 0.61: 49.53,124.46 48.26,123.19
  Bottom 0.813: 43.81,123.19 48.26,123.19 D5.A 49.53,124.46 T6.3 | 43.81,123.19 42.54,123.19 | 42.54,123.19 41.27,123.19 | 41.27,123.19 K6.16 | 42.54,124.46 U$11.A | 42.54,123.19 42.54,124.46 | 43.81,123.19 42.54,124.46 | 42.54,124.46 41.27,123.19
N$24
  Bottom 0.813: R4.1 51.44,152.4 T4.2
N$25
  Bottom 0.61: 48.26,146.05 49.53,147.32
  Bottom 0.813: T4.3 49.53,147.32 D7.A 48.26,146.05 43.81,146.05 | 41.27,146.05 K4.16 | 42.54,146.05 41.27,146.05 | 42.54,146.05 43.81,146.05 | 42.54,147.32 U$13.A | 42.54,147.32 42.54,146.05 | 42.54,147.32 43.81,146.05 | 42.54,147.32 41.27,146.05
N$26
  Bottom 0.813: R7.1 51.44,118.11 T7.2
N$27
  Bottom 0.61: 49.53,113.03 48.26,111.76
  Bottom 0.813: T7.3 49.53,113.03 D4.A 48.26,111.76 43.81,111.76 | 43.81,111.76 42.54,111.76 | 42.54,111.76 41.27,111.76 | 41.27,111.76 K7.16 | 42.54,113.03 U$10.A | 42.54,111.76 42.54,113.03 | 43.81,111.76 42.54,113.03 | 42.54,113.03 41.27,111.76
N$28
  Bottom 0.813: R8.1 51.44,106.68 T8.2
N$29
  Bottom 0.61: 49.53,101.6 48.26,100.33
  Bottom 0.813: T8.3 49.53,101.6 D3.A 48.26,100.33 43.81,100.33 | 43.81,100.33 42.54,100.33 | 42.54,100.33 41.27,100.33 | 41.27,100.33 K8.16 | 42.54,101.6 U$9.A | 42.54,100.33 42.54,101.6 | 43.81,100.33 42.54,101.6 | 42.54,101.6 41.27,100.33
N$30
  Bottom 0.813: IC3.12 69.22,145.41 R5.2
N$32
  Bottom 0.813: R34.1 V1.13
N$33
  Bottom 0.61: 92.08,67.31 92.08,31.75 90.8,30.48 IC1.1
  Bottom 0.813: JP1.1 JP1.3 JP1.5 JP1.7 JP1.9 JP1.11 JP1.13 JP1.15 88.9,71.75 92.08,68.58 92.08,67.31
N$34
  Bottom 0.61: IC7.14 80.64,64.77 IC3.1
N$35
  Bottom 0.813: X1.1 6.35,187.96 K1.S1
N$36
  Bottom 0.813: X1.2 6.35,182.88 8.89,180.34 K1.S2
N$37
  Bottom 0.813: X1.3 6.35,177.8 7.62,176.53 K2.S1
N$38
  Bottom 0.813: X1.4 6.35,172.72 10.16,168.91 K2.S2
N$39
  Bottom 0.813: X1.5 6.35,167.64 8.89,165.1 K3.S1
N$40
  Bottom 0.813: X1.6 6.35,162.56 11.43,157.48 K3.S2
N$41
  Bottom 0.813: X1.7 6.35,157.48 10.16,153.67 K4.S1
N$42
  Bottom 0.813: X1.8 6.35,152.4 12.7,146.05 K4.S2
N$43
  Bottom 0.813: X2.1 6.35,140.97 7.62,142.24 K5.S1
N$44
  Bottom 0.813: X2.2 6.35,135.89 7.62,134.62 K5.S2
N$45
  Bottom 0.813: X2.3 6.35,130.81 K6.S1
N$46
  Bottom 0.813: X2.4 6.35,125.73 8.89,123.19 K6.S2
N$47
  Bottom 0.813: X2.5 6.35,120.65 7.62,119.38 K7.S1
N$48
  Bottom 0.813: X2.6 6.35,115.57 10.16,111.76 K7.S2
N$49
  Bottom 0.813: X2.7 6.35,110.49 8.89,107.95 K8.S1
N$50
  Bottom 0.813: X2.8 6.35,105.41 11.43,100.33 K8.S2
N$51
  Bottom 0.813: U$16.K 42.54,186.69 43.81,187.96 R18.1
N$52
  Bottom 0.61: 49.53,90.17 48.26,88.9
  Bottom 0.813: 42.54,90.17 U$8.A | 42.54,90.17 42.54,88.9 | T1.3 49.53,90.17 D2.A 48.26,88.9 43.81,88.9 | 43.81,88.9 41.27,88.9 | 41.27,88.9 K9.16 | 43.81,88.9 42.54,90.17 | 41.27,88.9 42.54,90.17
N$53
  Bottom 0.406: 90.8,34.92 90.8,36.19
  Bottom 0.61: IC7.11 89.53,66.04 90.8,64.77 90.8,34.92 90.8,33.02 88.27,30.48 IC1.2
N$54
  Bottom 0.813: T10.2 51.44,83.82 R10.1
N$55
  Bottom 0.61: 49.53,78.74 48.26,77.47
  Bottom 0.813: 42.54,78.74 42.54,77.47 | T10.3 49.53,78.74 D10.A 48.26,77.47 43.81,77.47 | 43.81,77.47 41.27,77.47 | 41.27,77.47 K10.16 | 42.54,78.74 U$7.A | 43.81,77.47 42.54,78.74 | 41.27,77.47 42.54,78.74
N$56
  Bottom 0.813: T11.2 51.44,72.39 R11.1
N$57
  Bottom 0.61: 49.53,67.31 48.26,66.04
  Bottom 0.813: 42.54,67.31 U$6.A | 42.54,67.31 42.54,66.04 | T11.3 49.53,67.31 D16.A 48.26,66.04 43.81,66.04 | 43.81,66.04 41.27,66.04 | 41.27,66.04 K11.16 | 43.81,66.04 42.54,67.31 | 41.27,66.04 42.54,67.31
N$58
  Bottom 0.813: T12.2 51.44,60.96 R12.1
N$59
  Bottom 0.254: 107.88,113.46 111.28,111.19
N$60
  Bottom 0.61: 49.53,55.88 48.26,54.61
  Bottom 0.813: 42.54,55.88 42.54,54.61 | T12.3 49.53,55.88 D15.A 48.26,54.61 43.81,54.61 | 43.81,54.61 41.27,54.61 | 41.27,54.61 K12.16 | 43.81,54.61 42.54,55.88 | 42.54,55.88 U$5.A | 41.27,54.61 42.54,55.88
N$61
  Bottom 0.813: T13.2 51.44,49.53 R13.1
N$62
  Bottom 0.61: 49.53,44.45 48.26,43.18
  Bottom 0.813: T13.3 49.53,44.45 D14.A 48.26,43.18 43.81,43.18 | 43.81,43.18 42.54,43.18 | 42.54,43.18 41.27,43.18 | 41.27,43.18 K13.16 | 42.54,43.18 42.54,44.45 | 42.54,44.45 U$4.A | 43.81,43.18 42.54,44.45 | 42.54,44.45 41.27,43.18
N$63
  Bottom 0.813: T14.2 51.44,38.1 R14.1
N$64
  Bottom 0.61: 49.53,33.02 48.26,31.75
  Bottom 0.813: 43.81,31.75 48.26,31.75 D13.A 49.53,33.02 T14.3 | 43.81,31.75 42.54,31.75 | 42.54,31.75 41.27,31.75 | 41.27,31.75 K14.16 | 42.54,31.75 42.54,33.02 | 42.54,33.02 U$3.A | 43.81,31.75 42.54,33.02 | 42.54,33.02 41.27,31.75
N$65
  Bottom 0.813: R15.1 51.44,26.67 T15.2
N$66
  Bottom 0.61: 49.53,21.59 48.26,20.32
  Bottom 0.813: 42.54,21.59 U$2.A | 42.54,21.59 42.54,20.32 | T15.3 49.53,21.59 D12.A 48.26,20.32 43.81,20.32 | 43.81,20.32 41.27,20.32 | 41.27,20.32 K15.16 | 43.81,20.32 42.54,21.59 | 41.27,20.32 42.54,21.59
N$67
  Bottom 0.813: T16.2 51.44,15.24 R16.1
N$68
  Bottom 0.61: 49.53,10.16 48.26,8.89 | 43.81,8.89 42.54,10.16 41.27,8.89
  Bottom 0.813: U$1.A 42.54,10.16 42.54,8.89 | T16.3 49.53,10.16 D11.A 48.26,8.89 43.81,8.89 41.27,8.89 K16.16
N$69
  Bottom 0.406: IC2.7 79.38,59.05 78.74,59.69 78.74,92.71 75.56,95.88 R9.2
N$70
  Bottom 0.813: R10.2 68.58,83.82 73.02,79.38 IC2.9
N$71
  Bottom 0.813: R11.2 64.77,66.04 68.58,62.23 68.58,60.96 70.48,59.05 IC2.10
N$72
  Bottom 0.813: IC2.11 67.31,56.51 64.77,59.05 R12.2
N$73
  Bottom 0.813: IC2.15 71.75,46.35 69.22,43.81 69.22,19.69 R16.2
N$74
  Bottom 0.813: IC2.14 71.12,48.89 67.31,45.08 67.31,36.83 64.77,34.29 R15.2
N$75
  Bottom 0.813: IC2.13 70.48,51.43 64.77,45.72 R14.2
N$76
  Bottom 0.813: IC2.12 67.31,53.97 64.77,51.43 R13.2
N$77
  Bottom 0.61: IC3.2 81.28,137.79 83.19,135.89 83.19,64.13 86.36,60.96
  Bottom 0.813: 86.36,60.96 IC7.13 87.63,60.96
N$78
  Bottom 0.813: X3.1 6.35,92.07 10.8,96.52 K9.S1
N$79
  Bottom 0.813: X3.2 6.35,87 8.25,88.9 K9.S2
N$80
  Bottom 0.813: X3.3 6.35,81.91 9.52,85.09 K10.S1
N$81
  Bottom 0.813: X3.4 6.35,76.83 6.98,77.47 K10.S2
N$82
  Bottom 0.813: X3.5 6.35,71.75 8.25,73.66 K11.S1
N$83
  Bottom 0.813: X3.6 6.35,66.67 6.98,66.04 K11.S2
N$84
  Bottom 0.813: X3.7 6.35,61.59 6.98,62.23 K12.S1
N$85
  Bottom 0.813: X3.8 6.35,56.51 8.25,54.61 K12.S2
N$86
  Bottom 0.813: X4.1 6.35,45.72 11.43,50.8 K13.S1
N$87
  Bottom 0.813: X4.2 6.35,40.64 8.89,43.18 K13.S2
N$88
  Bottom 0.813: X4.3 6.35,35.56 10.16,39.37 K14.S1
N$89
  Bottom 0.813: X4.4 6.35,30.48 7.62,31.75 K14.S2
N$90
  Bottom 0.813: X4.5 6.35,25.4 8.89,27.94 K15.S1
N$91
  Bottom 0.813: X4.6 6.35,20.32 K15.S2
N$92
  Bottom 0.813: X4.7 6.35,15.24 7.62,16.51 K16.S1
N$93
  Bottom 0.813: X4.8 6.35,10.16 7.62,8.89 K16.S2
N$94
  Bottom 0.813: U$14.K 42.54,163.83 43.81,165.1 R20.1
N$95
  Bottom 0.813: U$15.K 42.54,175.26 43.81,176.53 R19.1
N$96
  Bottom 0.813: U$1.K 42.54,15.24 43.81,16.51 R32.1
N$97
  Bottom 0.61: IC3.3 83.19,140.34 84.45,139.06 84.45,65.41 86.36,63.5
  Bottom 0.813: 86.36,63.5 IC7.12
N$98
  Bottom 0.813: U$13.K 42.54,152.4 43.81,153.67 R17.1
N$109
  Bottom 0.813: 50.8,83.19 51.44,83.82 54.61,83.82
N$111
  Bottom 0.813: 50.8,71.75 51.44,72.39 54.61,72.39
N$112
  Bottom 0.813: U$17.A R33.1
N$113
  Bottom 0.813: 50.8,60.32 51.44,60.96 54.61,60.96
N$114
  Bottom 0.813: IC2.3 83.19,48.89 85.09,50.8 IC7.17
N$115
  Bottom 0.813: 50.8,48.89 51.44,49.53 54.61,49.53
N$117
  Bottom 0.813: 50.8,37.46 51.44,38.1 54.61,38.1
N$118
  Bottom 0.813: IC2.1 83.19,43.81 85.09,45.72 IC7.19
N$121
  Bottom 0.813: 50.8,14.6 51.44,15.24 54.61,15.24
N$128
  Bottom 0.254: 111.69,111.63 108.23,113.94
N$130
  Bottom 0.254: 108.23,115.46 111.71,117.73
N$138
  Bottom 0.61: 111.66,112.05 108.56,114.05 108.78,114.66 111.92,112.45 112.38,113.56 112.61,115.24 112.32,116.39 111.66,117.38 108.65,115.3 108.68,114.93 111.91,113.12 112.22,115.32 111.44,116.89 108.85,115.03 111.92,113.84 111.25,116.51 109.51,115.14 111.7,114.44 111.03,116.02 110.24,115.2 111.19,115.13 112.27,115.29
N$147
  Bottom 0.61: 110.8,111.11 109.08,110.28 107.73,110.24 106.45,110.54 105.59,110.97 104.76,111.83 104,112.86 103.65,114.1 104.86,113.95 105.69,112.92 106.85,112.72 107.35,112.83 107.9,113.09 110.43,111.37 109.65,110.92 109.62,111.25 107.6,112.65 107.14,112.42 109.42,110.72 106.42,110.74 104.2,112.88 104.34,113.83 105.1,113.15 104.54,112.98 105.46,112.58 105.6,111.87 106.08,112.55 106.03,111.44 106.72,112.49 106.41,111.04 107.13,112.14 107,110.92 107.52,111.71 107.76,111.05 108.38,111.24
N$148
  Bottom 0.61: 24.13,17.14 24.77,16.51 | 24.13,29.21 25.4,27.94 24.13,26.67 | 24.13,38.1 25.4,39.37 24.13,40.64 | 24.13,49.53 25.4,50.8 24.13,52.07 | 24.13,63.5 25.4,62.23 24.13,60.96 | 24.13,72.39 25.4,73.66 24.13,74.93 | 24.13,108.58 24.77,107.95 | 24.13,120.65 25.4,119.38 24.13,118.11 | 24.13,129.54 25.4,130.81 24.13,132.08 | 24.13,140.97 25.4,142.24 24.13,143.51 | 24.13,154.94 25.4,153.67 24.13,152.4 | 24.13,163.83 25.4,165.1 24.13,166.37
  Bottom 0.813: 24.13,62.23 24.13,63.5 24.13,72.39 24.13,73.66 | 24.13,50.8 24.13,52.07 24.13,60.96 24.13,62.23 | 24.13,50.8 24.13,49.53 24.13,40.64 24.13,39.37 | 24.13,39.37 24.13,38.1 24.13,29.21 24.13,27.94 | 24.13,27.94 24.13,26.67 24.13,17.14 24.13,16.51 24.77,16.51 K16.P1 | 24.13,73.66 24.13,74.93 24.13,83.82 | 24.13,85.09 24.13,83.82 | 24.13,96.52 24.13,95.25 | 24.13,95.25 24.13,86.36 | 24.13,86.36 24.13,85.09 | 24.13,85.09 25.4,85.09 | 25.4,85.09 K10.P1 | 24.13,73.66 25.4,73.66 K11.P1 | 24.13,39.37 25.4,39.37 K14.P1 | 24.13,27.94 25.4,27.94 K15.P1 | K13.P1 25.4,50.8 24.13,50.8 | 24.13,62.23 25.4,62.23 K12.P1 | 25.4,85.09 24.13,83.82 | 24.13,86.36 25.4,85.09 | 25.4,96.52 24.13,95.25 | 24.13,153.67 24.13,154.94 24.13,163.83 24.13,165.1 | 24.13,142.24 24.13,143.51 24.13,152.4 24.13,153.67 | 24.13,142.24 24.13,140.97 24.13,132.08 24.13,130.81 | 24.13,130.81 24.13,129.54 24.13,120.65 24.13,119.38 | 24.13,119.38 24.13,118.11 24.13,109.22 | 24.13,109.22 24.13,108.58 24.13,107.95 | 24.13,165.1 24.13,166.37 24.13,176.53 | 24.13,176.53 24.13,187.96 | 24.13,107.95 24.77,107.95 25.4,107.95 | 25.4,107.95 K8.P1 | 24.13,176.53 K2.P1 | 24.13,165.1 25.4,165.1 K3.P1 | 24.13,130.81 25.4,130.81 K6.P1 | 24.13,119.38 25.4,119.38 K7.P1 | K5.P1 25.4,142.24 24.13,142.24 | 24.13,153.67 25.4,153.67 K4.P1 | 24.13,106.68 24.13,107.95 | 24.13,106.68 24.13,97.79 | 24.13,97.79 24.13,96.52 | 24.13,96.52 24.13,94.61 | 24.13,96.52 25.4,96.52 | 25.4,96.52 K9.P1 | 24.13,97.79 25.4,96.52 | 25.4,107.95 24.13,106.68 | 24.13,109.22 25.4,107.95 | 24.13,187.96 K1.P1 | 24.13,187.96 24.13,191.13 28.57,195.58 95.25,195.58 110.49,180.34 X5.2
N$150
  Bottom 0.813: U$12.K 42.54,140.97 43.81,142.24 R21.1
N$153
  Bottom 0.813: U$11.K 42.54,129.54 43.81,130.81 R22.1
N$156
  Bottom 0.813: U$10.K 42.54,118.11 43.81,119.38 R23.1
N$160
  Bottom 0.813: U$9.K 42.54,106.68 43.81,107.95 R24.1
N$163
  Bottom 0.813: U$8.K 42.54,95.25 43.81,96.52 R25.1
N$165
  Bottom 0.813: U$7.K 42.54,83.82 43.81,85.09 R26.1
N$169
  Bottom 0.813: U$6.K 42.54,72.39 43.81,73.66 R27.1
N$171
  Bottom 0.813: U$5.K 42.54,60.96 43.81,62.23 R28.1
N$174
  Bottom 0.813: U$4.K 42.54,49.53 43.81,50.8 R29.1
N$177
  Bottom 0.813: U$3.K 42.54,38.1 43.81,39.37 R30.1
N$180
  Bottom 0.813: U$2.K 42.54,26.67 43.81,27.94 R31.1
N$14823
  Bottom 0.61: 29.21,10.16 27.94,8.89 | 29.21,20.95 28.57,20.32 29.21,19.69 | 29.21,30.48 27.94,31.75 29.21,33.02 | 29.21,44.45 27.94,43.18 29.21,41.91 | 29.21,53.34 27.94,54.61 29.21,55.88 | 29.21,64.77 27.94,66.04 29.21,67.31 | 27.94,88.9 29.21,87.63
  Bottom 0.813: 29.21,31.75 27.94,31.75 K14.P2 | 29.21,31.75 29.21,30.48 29.21,20.95 29.21,20.32 | 29.21,20.32 28.57,20.32 K15.P2 | 29.21,20.32 29.21,19.69 29.21,10.16 29.21,8.89 27.94,8.89 K16.P2 | 29.21,43.18 27.94,43.18 K13.P2 | 29.21,43.18 29.21,41.91 29.21,33.02 29.21,31.75 | K12.P2 27.94,54.61 29.21,54.61 | 29.21,54.61 29.21,53.34 29.21,44.45 29.21,43.18 | 29.21,66.04 27.94,66.04 K11.P2 | 29.21,54.61 29.21,55.88 29.21,64.77 29.21,66.04 | 29.21,77.47 K10.P2 | 29.21,66.04 29.21,67.31 29.21,77.47 | 29.21,77.47 29.21,87.63 29.21,88.9 | 29.21,88.9 27.94,88.9 | 27.94,88.9 K9.P2 | 29.21,90.17 29.21,88.9 | 29.21,100.33 27.94,100.33 | 27.94,100.33 K8.P2 | 29.21,157.48 29.21,165.1 | 29.21,157.48 29.21,146.05 | 29.21,146.05 29.21,134.62 | 29.21,134.62 29.21,123.19 | 29.21,123.19 29.21,111.76 | 29.21,111.76 29.21,101.6 | 29.21,101.6 29.21,100.33 | 29.21,165.1 29.21,166.37 | 29.21,90.17 27.94,88.9 | 29.21,100.33 29.21,99.06 | 29.21,99.06 29.21,90.17 | 27.94,100.33 29.21,99.06 | 29.21,101.6 27.94,100.33 | 29.21,111.76 K7.P2 | 29.21,123.19 K6.P2 | 29.21,134.62 K5.P2 | 29.21,146.05 K4.P2 | 29.21,157.48 K3.P2 | 29.21,165.1 29.21,168.28 | 29.21,168.28 29.21,180.34 | K2.P2 28.57,168.91 29.21,168.28 | 29.21,180.34 K1.P2 | 29.21,180.34 29.21,189.87 32.38,193.04 88.9,193.04 109.19,172.75 X5.1
PB0
  Bottom 0.813: BUS.2 IC7.2
PB1
  Bottom 0.813: BUS.4 IC7.3
PB2
  Bottom 0.813: BUS.6 IC7.4
PB3
  Bottom 0.813: BUS.8 IC7.5
PB4
  Bottom 0.813: BUS.10 IC7.6
PB5
  Bottom 0.813: BUS.12 IC7.7
PB6
  Bottom 0.813: BUS.14 IC7.8
PB7
  Bottom 0.813: IC7.9 96.52,63.5 97.16,62.86 106.68,62.86 BUS.16
PE
  Bottom 0.406: 102.23,139.06 106.05,139.06 | 88.9,57.15 85.09,57.15
  Bottom 0.61: 31.75,17.78 33.02,16.51 31.75,15.24 | 31.75,26.67 33.02,27.94 31.75,29.21 | 31.75,38.1 33.02,39.37 31.75,40.64 | 31.75,49.53 33.02,50.8 31.75,52.07 | 31.75,60.96 33.02,62.23 31.75,63.5 | 31.75,72.39 33.02,73.66 31.75,74.93 | 31.75,83.82 33.02,85.09 31.75,86.36 | 33.02,96.52 31.75,95.25 | 108.59,64.77 106.05,64.77 | IC1.7 85.09,37.46 89.53,41.91 89.53,56.51 88.9,57.15 | IC2.8 81.91,61.59 82.55,60.96 82.55,59.05 83.19,58.42 83.82,58.42 85.09,57.15 | 101.6,139.06 106.05,139.06
  Bottom 0.813: 33.02,96.52 31.75,96.52 31.75,95.25 31.75,86.36 31.75,85.09 | 33.02,96.52 K9.1 R25.2 | 31.75,85.09 33.02,85.09 K10.1 R26.2 | 31.75,73.66 33.02,73.66 K11.1 R27.2 | 31.75,73.66 31.75,74.93 31.75,83.82 31.75,85.09 | 31.75,62.23 33.02,62.23 K12.1 R28.2 | 31.75,62.23 31.75,63.5 31.75,72.39 31.75,73.66 | 31.75,50.8 33.02,50.8 K13.1 R29.2 | 31.75,50.8 31.75,52.07 31.75,60.96 31.75,62.23 | 31.75,39.37 33.02,39.37 K14.1 R30.2 | 31.75,50.8 31.75,49.53 31.75,40.64 31.75,39.37 | 31.75,27.94 33.02,27.94 K15.1 R31.2 | 31.75,39.37 31.75,38.1 31.75,29.21 31.75,27.94 | 31.75,16.51 33.02,16.51 K16.1 R32.2 | 31.75,27.94 31.75,26.67 31.75,17.78 31.75,16.51 | 31.75,16.51 31.75,15.24 31.75,6.98 33.02,5.71 80.64,5.71 103.5,28.58 | 109.85,59.69 BUS.11 111.12,58.42 | 109.85,59.69 BUS.13 BUS.15 108.59,64.77 | 113.03,58.42 111.12,58.42 | 111.12,58.42 109.85,59.69 | 33.02,187.96 31.75,187.96 31.75,186.69 | 33.02,187.96 K1.1 R18.2 | 31.75,176.53 31.75,177.8 | 31.75,177.8 31.75,186.69 | 31.75,165.1 31.75,166.37 | 31.75,166.37 31.75,175.26 | 31.75,175.26 31.75,176.53 | 31.75,153.67 31.75,154.94 | 31.75,154.94 31.75,163.83 | 31.75,163.83 31.75,165.1 | 31.75,143.51 31.75,142.24 | 31.75,152.4 31.75,143.51 | 31.75,153.67 31.75,152.4 | 31.75,142.24 31.75,140.97 | 31.75,140.97 31.75,132.08 | 31.75,132.08 31.75,130.81 | 31.75,130.81 31.75,129.54 | 31.75,129.54 31.75,120.65 | 31.75,120.65 31.75,119.38 | 31.75,119.38 31.75,118.11 | 31.75,118.11 31.75,109.22 | 31.75,109.22 31.75,107.95 | 31.75,176.53 33.02,176.53 | 33.02,176.53 K2.1 R19.2 | 31.75,165.1 33.02,165.1 | 33.02,165.1 K3.1 R20.2 | 33.02,153.67 31.75,153.67 | 33.02,153.67 K4.1 R17.2 | 31.75,142.24 33.02,142.24
  Bottom 0.813: 33.02,142.24 K5.1 R21.2 | 31.75,130.81 33.02,130.81 | 33.02,130.81 K6.1 R22.2 | 31.75,119.38 33.02,119.38 | 33.02,119.38 K7.1 R23.2 | 31.75,107.95 33.02,107.95 | 33.02,107.95 K8.1 R24.2 | 31.75,107.95 31.75,106.68 | 31.75,106.68 31.75,97.79 | 31.75,97.79 31.75,95.88 | 31.75,97.79 33.02,96.52 | 33.02,119.38 31.75,118.11 | 31.75,120.65 33.02,119.38 | 33.02,107.95 31.75,106.68 | 31.75,109.22 33.02,107.95 | 33.02,130.81 31.75,129.54 | 31.75,132.08 33.02,130.81 | 33.02,142.24 31.75,140.97 | 31.75,143.51 33.02,142.24 | 33.02,153.67 31.75,152.4 | 33.02,153.67 31.75,154.94 | 31.75,163.83 33.02,165.1 | 33.02,165.1 31.75,166.37 | 31.75,175.26 33.02,176.53 | 33.02,176.53 31.75,177.8 | 31.75,186.69 33.02,187.96 | 114.94,56.51 113.03,58.42 | 114.94,56.51 114.94,40.64 106.68,31.75 104.78,29.84 | 103.5,28.58 104.14,29.21 | 104.14,29.21 104.78,29.84 | 103.5,29.84 101.6,31.75 IC8.2 101.6,38.73 97.16,43.18 IC7.1 94.61,27.94 90.17,23.49 76.83,23.49 75.56,24.77 IC1.7 | 104.14,29.21 103.5,29.84 | 103.5,29.84 104.78,29.84 | 103.5,28.58 103.5,29.84 | V1.7 109.85,154.94 109.22,154.94 | 94.61,154.94 93.34,154.94 | 107.95,154.94 109.22,154.94 | 107.95,154.94 106.68,154.94 | 106.68,154.94 94.61,154.94 | 93.34,153.67 93.34,148.59 92.08,147.32 88.27,147.32 82.55,153.03 IC3.8 80.64,170.18 81.91,171.45 K17.P2 | 93.34,154.94 93.34,153.67 | 93.34,154.94 T17.E 93.34,153.67 | 94.61,154.94 93.34,153.67 | 114.94,56.51 114.94,60.32 | 114.94,60.32 114.94,92.07 109.22,97.79 102.87,97.79 100.33,100.33 100.33,137.79 101.6,139.06 102.23,139.06 | 113.03,58.42 114.3,58.42 114.3,57.78 113.66,57.78 113.03,58.42 | 113.03,58.42 114.94,60.32 | 114.94,60.32 114.94,59.69 114.3,59.05
  Bottom 0.813: 106.05,139.06 106.68,139.06 107.95,140.34 107.95,153.67 | 107.95,153.67 107.95,154.94 | 107.95,153.67 109.22,154.94 | 107.95,153.67 106.68,154.94 | 106.05,64.77 97.16,64.77 95.88,66.04 IC7.10
(copper drawn outside any net)
  Bottom 0.254: 105.06,114.33 arc125 107.96,113.56 | 108.16,115.56 arc-58 108.21,113.91 | 103.36,114.36 arc128 111.31,111.19 | 111.69,117.83 arc-82 111.69,111.61
  shapes: Bottom circle x10

### Text on the board
Bottom: Controle 16 Relés - Abril 2006 | LMPT